# EAGLE board toyotune_3s_lvc_dil28 (EAGLE 5.11)
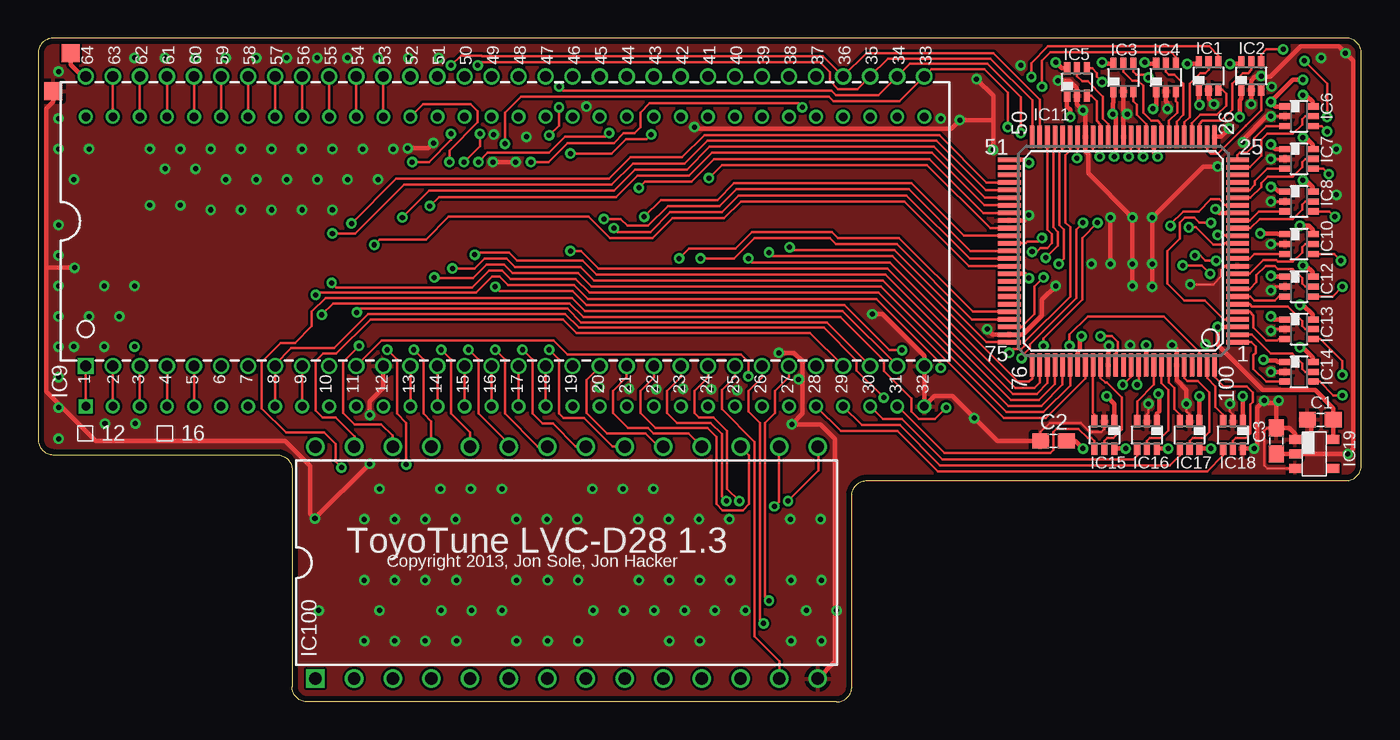
[diagram p4: board, top side]
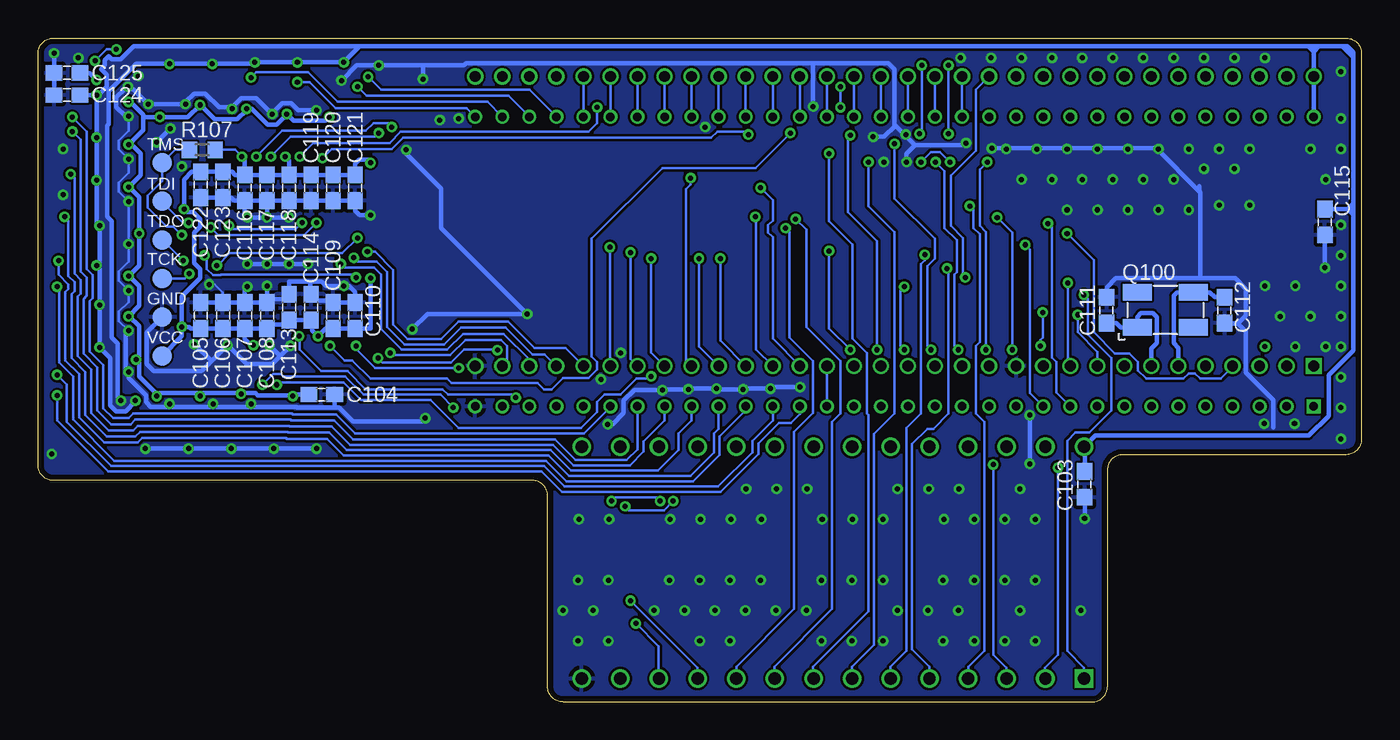
[diagram p5: board, bottom side, seen from below]

Size 87 x 43.65 mm. Coordinates in mm from the lower left corner, seen from the top.
Outline: 1.05,43.65 arc90 0,42.65 0,17.25 arc90 1,16.25 15.7,16.25 arc-90 16.7,15.25 16.7,1 arc90 17.7,0 52.5,0 arc90 53.5,1 53.5,13.55 arc-90 54.5,14.55 86,14.55 arc90 87,15.55 87,42.65 arc90 86,43.65 1.05,43.65
Copper layers (1*16): Top 0.0356mm / dielectric 1.5011mm / Bottom 0.0356mm
Design rules "laen-pcb-order *": minimum track width 6mil, minimum drill 13mil, track to track 6mil, track to pad 6mil, pad to pad 6mil, via to via 6mil, smd to smd 6mil, copper to edge 15mil, drill to drill 6mil, minimum pad ring 7mil, minimum via ring 7mil, stop-mask expansion 4mil, vias tented up to drill 13mil, thermal gap 10mil

## Footprints (pad centres in the part's own frame; a part is rotated, then mirrored left to right if it is on the bottom)
C0603 = smd 1.1 x 1: 1 -0.85,0; 2 0.85,0
DCK_R-PDSO-G6 = smd 0.4 x 0.8: 1 -0.65,-0.9; 2 0,-0.9; 3 0.65,-0.9; 4 0.65,0.9; 5 0,0.9; 6 -0.65,0.9
SDIP-64 = drill 0.711 square: 1 -27.559,-9.525 | drill 0.711 round: 2 -25.781,-9.525; 3 -24.003,-9.525; 4 -22.225,-9.525; 5 -20.447,-9.525; 6 -18.669,-9.525; 7 -16.891,-9.525; 8 -15.113,-9.525; 9 -13.335,-9.525; 10 -11.557,-9.525; 11 -9.779,-9.525; 12 -8.001,-9.525; 13 -6.223,-9.525; 14 -4.445,-9.525; 15 -2.667,-9.525; 16 -0.889,-9.525; 17 0.889,-9.525; 18 2.667,-9.525; 19 4.445,-9.525; 20 6.223,-9.525; 21 8.001,-9.525; 22 9.779,-9.525; 23 11.557,-9.525; 24 13.335,-9.525; 25 15.113,-9.525; 26 16.891,-9.525; 27 18.669,-9.525; 28 20.447,-9.525; 29 22.225,-9.525; 30 24.003,-9.525; 31 25.781,-9.525; 32 27.559,-9.525; 33 27.559,9.525; 34 25.781,9.525; 35 24.003,9.525; 36 22.225,9.525; 37 20.447,9.525; 38 18.669,9.525; 39 16.891,9.525; 40 15.113,9.525; 41 13.335,9.525; 42 11.557,9.525; 43 9.779,9.525; 44 8.001,9.525; 45 6.223,9.525; 46 4.445,9.525; 47 2.667,9.525; 48 0.889,9.525; 49 -0.889,9.525; 50 -2.667,9.525; 51 -4.445,9.525; 52 -6.223,9.525; 53 -8.001,9.525; 54 -9.779,9.525; 55 -11.557,9.525; 56 -13.335,9.525; 57 -15.113,9.525; 58 -16.891,9.525; 59 -18.669,9.525; 60 -20.447,9.525; 61 -22.225,9.525; 62 -24.003,9.525; 63 -25.781,9.525; 64 -27.559,9.525
VQ100 = smd 1.5 x 0.3: 1 -7.5,6; 2 -7.5,5.5; 3 -7.5,5; 4 -7.5,4.5; 5 -7.5,4; 6 -7.5,3.5; 7 -7.5,3; 8 -7.5,2.5; 9 -7.5,2; 10 -7.5,1.5; 11 -7.5,1; 12 -7.5,0.5; 13 -7.5,0; 14 -7.5,-0.5; 15 -7.5,-1; 16 -7.5,-1.5; 17 -7.5,-2; 18 -7.5,-2.5; 19 -7.5,-3; 20 -7.5,-3.5; 21 -7.5,-4; 22 -7.5,-4.5; 23 -7.5,-5; 24 -7.5,-5.5; 25 -7.5,-6; 51 7.5,-6; 52 7.5,-5.5; 53 7.5,-5; 54 7.5,-4.5; 55 7.5,-4; 56 7.5,-3.5; 57 7.5,-3; 58 7.5,-2.5; 59 7.5,-2; 60 7.5,-1.5; 61 7.5,-1; 62 7.5,-0.5; 63 7.5,0; 64 7.5,0.5; 65 7.5,1; 66 7.5,1.5; 67 7.5,2; 68 7.5,2.5; 69 7.5,3; 70 7.5,3.5; 71 7.5,4; 72 7.5,4.5; 73 7.5,5; 74 7.5,5.5; 75 7.5,6 | smd 0.3 x 1.5: 26 -6,-7.5; 27 -5.5,-7.5; 28 -5,-7.5; 29 -4.5,-7.5; 30 -4,-7.5; 31 -3.5,-7.5; 32 -3,-7.5; 33 -2.5,-7.5; 34 -2,-7.5; 35 -1.5,-7.5; 36 -1,-7.5; 37 -0.5,-7.5; 38 0,-7.5; 39 0.5,-7.5; 40 1,-7.5; 41 1.5,-7.5; 42 2,-7.5; 43 2.5,-7.5; 44 3,-7.5; 45 3.5,-7.5; 46 4,-7.5; 47 4.5,-7.5; 48 5,-7.5; 49 5.5,-7.5; 50 6,-7.5; 76 6,7.5; 77 5.5,7.5; 78 5,7.5; 79 4.5,7.5; 80 4,7.5; 81 3.5,7.5; 82 3,7.5; 83 2.5,7.5; 84 2,7.5; 85 1.5,7.5; 86 1,7.5; 87 0.5,7.5; 88 0,7.5; 89 -0.5,7.5; 90 -1,7.5; 91 -1.5,7.5; 92 -2,7.5; 93 -2.5,7.5; 94 -3,7.5; 95 -3.5,7.5; 96 -4,7.5; 97 -4.5,7.5; 98 -5,7.5; 99 -5.5,7.5; 100 -6,7.5
DDC_R-PDSO-G5 = smd 0.6 x 0.8: 1 -0.95,-1.25; 2 0,-1.25; 3 0.95,-1.25; 4 0.95,1.25; 5 -0.95,1.25
PDIP28 = drill 0.813 square: 1 -16.51,-7.62 | drill 0.813 round: 2 -13.97,-7.62; 3 -11.43,-7.62; 4 -8.89,-7.62; 5 -6.35,-7.62; 6 -3.81,-7.62; 7 -1.27,-7.62; 8 1.27,-7.62; 9 3.81,-7.62; 10 6.35,-7.62; 11 8.89,-7.62; 12 11.43,-7.62; 13 13.97,-7.62; 14 16.51,-7.62; 15 16.51,7.62; 16 13.97,7.62; 17 11.43,7.62; 18 8.89,7.62; 19 6.35,7.62; 20 3.81,7.62; 21 1.27,7.62; 22 -1.27,7.62; 23 -3.81,7.62; 24 -6.35,7.62; 25 -8.89,7.62; 26 -11.43,7.62; 27 -13.97,7.62; 28 -16.51,7.62
1X06_SMD = smd 1.27 x 1.27: GND 3.81,0; TCK 1.27,0; TDI -3.81,0; TDO -1.27,0; TMS -6.35,0; VCC 6.35,0
CRYSTAL-SMD-5X3 = smd 1.9 x 1.1: 1 -1.85,-1.15; 2 1.85,-1.15; 3 1.85,1.15; 4 -1.85,1.15
R0603 = smd 1 x 1.1: 1 -0.85,0; 2 0.85,0
TP12SQ = smd 1.2 x 1.2: TP 0,0
SDIP-64-CONN = drill 0.559 square: 1 -27.559,-9.525 | drill 0.559 round: 2 -25.781,-9.525; 3 -24.003,-9.525; 4 -22.225,-9.525; 5 -20.447,-9.525; 6 -18.669,-9.525; 7 -16.891,-9.525; 8 -15.113,-9.525; 9 -13.335,-9.525; 10 -11.557,-9.525; 11 -9.779,-9.525; 12 -8.001,-9.525; 13 -6.223,-9.525; 14 -4.445,-9.525; 15 -2.667,-9.525; 16 -0.889,-9.525; 17 0.889,-9.525; 18 2.667,-9.525; 19 4.445,-9.525; 20 6.223,-9.525; 21 8.001,-9.525; 22 9.779,-9.525; 23 11.557,-9.525; 24 13.335,-9.525; 25 15.113,-9.525; 26 16.891,-9.525; 27 18.669,-9.525; 28 20.447,-9.525; 29 22.225,-9.525; 30 24.003,-9.525; 31 25.781,-9.525; 32 27.559,-9.525; 33 27.559,9.525; 34 25.781,9.525; 35 24.003,9.525; 36 22.225,9.525; 37 20.447,9.525; 38 18.669,9.525; 39 16.891,9.525; 40 15.113,9.525; 41 13.335,9.525; 42 11.557,9.525; 43 9.779,9.525; 44 8.001,9.525; 45 6.223,9.525; 46 4.445,9.525; 47 2.667,9.525; 48 0.889,9.525; 49 -0.889,9.525; 50 -2.667,9.525; 51 -4.445,9.525; 52 -6.223,9.525; 53 -8.001,9.525; 54 -9.779,9.525; 55 -11.557,9.525; 56 -13.335,9.525; 57 -15.113,9.525; 58 -16.891,9.525; 59 -18.669,9.525; 60 -20.447,9.525; 61 -22.225,9.525; 62 -24.003,9.525; 63 -25.781,9.525; 64 -27.559,9.525

## Placement (x,y rotation side)
C1  1uF  [C0603]  84.3,18.55 180 top
C2  0.1uF  [C0603]  66.75,17.15 0 top
C3  1uF  [C0603]  81.4,17.15 270 top
C103  0.1uF  [C0603]  18.2,14.3 90 bottom
C104  0.1uF  [C0603]  68.35,20.2 180 bottom
C105  0.1uF  [C0603]  76.3,25.4 270 bottom
C106  0.01uF  [C0603]  74.85,25.4 270 bottom
C107  0.1uF  [C0603]  73.4,25.4 270 bottom
C108  0.01uF  [C0603]  71.95,25.4 270 bottom
C109  0.01uF  [C0603]  67.6,25.4 270 bottom
C110  0.1uF  [C0603]  66.15,25.4 270 bottom
C111  10pF  [C0603]  16.75,25.75 90 bottom
C112  10pF  [C0603]  9,25.75 90 bottom
C113  0.01uF  [C0603]  70.5,25.95 270 bottom
C114  0.1uF  [C0603]  69.05,25.95 270 bottom
C115  0.1uF  [C0603]  2.4,31.55 90 bottom
C116  0.1uF  [C0603]  73.4,33.8 90 bottom
C117  0.01uF  [C0603]  71.95,33.8 90 bottom
C118  0.01uF  [C0603]  70.5,33.8 90 bottom
C119  0.1uF  [C0603]  69.05,33.8 90 bottom
C120  0.1uF  [C0603]  67.6,33.8 90 bottom
C121  0.01uF  [C0603]  66.15,33.8 90 bottom
C122  0.01uF  [C0603]  76.3,34 90 bottom
C123  0.1uF  [C0603]  74.85,34 90 bottom
C124  0.1uF  [C0603]  85.1,39.9 0 bottom
C125  0.1uF  [C0603]  85.1,41.35 0 bottom
IC1  SN74LVC1T45DCK  [DCK_R-PDSO-G6]  76.95,41.15 0 top
IC2  SN74LVC1T45DCK  [DCK_R-PDSO-G6]  79.75,41.15 0 top
IC3  SN74LVC1T45DCK  [DCK_R-PDSO-G6]  71.35,41.05 0 top
IC4  SN74LVC1T45DCK  [DCK_R-PDSO-G6]  74.15,41.05 0 top
IC5  SN74LVC1T45DCK  [DCK_R-PDSO-G6]  68.3,40.75 0 top
IC6  SN74LVC1T45DCK  [DCK_R-PDSO-G6]  82.9,38.5 270 top
IC7  SN74LVC1T45DCK  [DCK_R-PDSO-G6]  82.9,35.7 270 top
IC8  SN74LVC1T45DCK  [DCK_R-PDSO-G6]  82.9,32.9 270 top
IC9  D15180X-XXXX  [SDIP-64]  30.7,31.6 0 top
IC10  SN74LVC1T45DCK  [DCK_R-PDSO-G6]  82.9,30.1 270 top
IC11  XCR3128XL  [VQ100]  71.35,29.65 180 top
IC12  SN74LVC1T45DCK  [DCK_R-PDSO-G6]  82.9,27.3 270 top
IC13  SN74LVC1T45DCK  [DCK_R-PDSO-G6]  82.9,24.5 270 top
IC14  SN74LVC1T45  [DCK_R-PDSO-G6]  82.9,21.7 270 top
IC15  SN74LVC1T45DCK  [DCK_R-PDSO-G6]  70.1,17.55 180 top
IC16  SN74LVC1T45DCK  [DCK_R-PDSO-G6]  72.9,17.55 180 top
IC17  SN74LVC1T45DCK  [DCK_R-PDSO-G6]  75.7,17.55 180 top
IC18  SN74LVC1T45DCK  [DCK_R-PDSO-G6]  78.55,17.55 180 top
IC19  TLV70033  [DDC_R-PDSO-G5]  83.9,16.3 270 top
IC100  AT29C256  [PDIP28]  34.75,9.15 0 top
JP100  JTAG  [1X06_SMD]  78.85,29.1 270 bottom
Q100  16Mhz  [CRYSTAL-SMD-5X3]  12.89,25.77 0 bottom
R107  10K  [R0603]  76.2,36.3 0 bottom
TP_GND  TPSQTP12SQ  [TP12SQ]  1,40.15 0 top
TP_VCC  TPSQTP12SQ  [TP12SQ]  2.15,42.65 0 top
U1  D151803-CONN  [SDIP-64-CONN]  30.7,28.95 0 top

## Tracks (layer width: path | path; a pad name or v marks a point on that pad's centre or on a via)
!D_HALT
  Bottom 0.178: IC9.51 U1.51
!D_INIT  (via drill 0.33)
  Top 0.178: IC11.81 67.85,20.8 66.1,19.05 63.65,19.05 55.4,27.3 36.4,27.3 35.5,28.2 31.2,28.2 30.65,28.75 29.5,28.75 28.6,27.85 26.1,27.85 v26.05,27.9
  Bottom 0.178: v26.05,27.9 26.2,28.05 26.2,30.5 27,31.3 27,34.6 25.35,36.25 25.35,40.25 IC9.52
!D_IRL
  Top 0.178: IC9.5 U1.5
!D_IRP  (via drill 0.33)
  Top 0.178: IC9.4 U1.4 | IC11.55 62.3,33.65 59.05,36.9 44,36.9 42.5,35.4 39.1,35.4 37.7,34 24.05,34 20.85,30.8 v19.35,30.8
  Bottom 0.178: IC9.4 8.47,22.02 9.25,21.25 10.6,21.25 10.95,21.6 11.35,21.6 11.7,21.25 14.15,21.25 14.7,21.8 14.7,22.35 15.25,22.9 16.2,22.9 17.6,24.3 17.6,29.05 v19.35,30.8
!D_NMI
  Top 0.178: IC9.3 U1.3
!D_RD  (via drill 0.33)
  Top 0.178: IC11.83 68.85,21.25 66.25,18.65 63.5,18.65 55.25,26.9 36.25,26.9 35.35,27.8 31.05,27.8 30.5,28.35 29.65,28.35 28.55,27.25 19.6,27.25 v19.3,27.55
  Bottom 0.178: IC9.10 19.3,22.23 v19.3,27.55
!D_TEST
  Bottom 0.178: U1.49 IC9.49
!D_WDC
  Top 0.178: IC9.53 U1.53
!D_WI
  Bottom 0.178: IC9.50 U1.50
!D_WR  (via drill 0.33)
  Top 0.178: v46.7,21.4 46.7,22.35 46.2,22.85 34.8,22.85 33.9,23.75 22.6,23.75 IC9.11 | IC11.89 71.85,21.35 71.3,20.8 v71.3,20.85
  Bottom 0.178: v46.7,21.4 46.85,21.25 47.65,21.25 48.7,20.2 49.75,20.2 50.25,19.7 50.25,19.05 51.3,18 59.35,18 61.2,19.85 65.75,19.85 66.9,21 71.15,21 v71.3,20.85
!E_INIT  (via drill 0.33)
  Top 0.178: IC11.98 76.35,23 74,25.35 69,25.35 67.8,24.15 v67.8,23.4 | U1.52 25.3,39.3 28.45,39.3 28.9,38.85 28.9,38.1 27.05,36.25 v27.05,35.5 | v37.55,37.4 37.3,37.15 34.65,37.15 33.6,36.1 29.55,36.1 v28.95,35.5
  Bottom 0.178: v37.55,37.4 39.85,35.1 45.95,35.1 50.6,30.45 50.6,22.7 50.25,22.35 50.25,21.85 50.8,21.3 52.5,21.3 53.25,20.55 53.75,20.55 54.15,20.95 59.8,20.95 60.1,21.25 65.15,21.25 66.35,22.45 66.85,22.45 v67.8,23.4 | v28.95,35.5 28.3,36.15 27.7,36.15 v27.05,35.5
!E_IS  (via drill 0.33)
  Top 0.178: IC11.54 62.35,34.15 59.25,37.25 43.8,37.25 42.35,35.8 38.95,35.8 37.55,34.4 23.55,34.4 v20.6,31.45
  Bottom 0.178: U1.10 20.05,20.33 20.05,22.35 20.35,22.65 20.35,31.2 v20.6,31.45
!E_OS  (via drill 0.33)
  Top 0.178: IC11.65 61.2,28.65 56.95,32.9 46.2,32.9 45.1,31.8 41.7,31.8 40.4,30.5 37.6,30.5 36.2,31.9 27,31.9 25.5,30.4 22.45,30.4 v22.1,30.05
  Bottom 0.178: U1.11 21.8,20.3 21.8,24.4 21.8,29.75 v22.1,30.05
!M_RD  (via drill 0.33)
  Top 0.178: IC11.14 78.05,30.15 77.95,30.05 77.25,30.05 76.1,31.2 v75.65,31.2 | v30.05,23.15 30.7,22.5 30.7,18.95 32.85,16.8 33.45,16.8 IC100.22 | v30.05,27.3 30.35,27 35.15,27 36.05,26.1 53,26.1 55.97,23.12 v56.8,23.12 | v68.7,31.5 68.25,31.05 68.25,26.55 65.2,23.5 65.2,23.25 64.65,22.7 v64.65,22.6
  Bottom 0.178: v75.65,31.2 75.15,30.7 69.5,30.7 v68.7,31.5 | v30.05,23.15 30.3,23.4 30.3,27.05 v30.05,27.3 | v56.8,23.12 56.77,23.15 59,23.15 59.85,22.3 64.35,22.3 v64.65,22.6
!M_ROM_CS  (via drill 0.33)
  Top 0.178: IC11.78 66.35,20.95 65.65,20.25 64.1,20.25 55.85,28.5 36.85,28.5 35.7,29.65 v35,29.65 | v33.6,23.15 34.25,22.5 34.25,18.95 34.55,18.65 35.9,18.65 37.75,16.8 38.53,16.8 IC100.20
  Bottom 0.178: v33.6,23.15 35,24.55 v35,29.65
!M_WR  (via drill 0.33)
  Top 0.178: IC11.19 78.05,32.65 77.65,33.05 77.1,33.05 76.3,32.25 75.3,32.25 74.45,31.4 v74.45,31.3 | v59.35,21.95 59.35,22.25 55.1,26.5 36.15,26.5 35.25,27.4 30.9,27.4 30.35,27.95 29.85,27.95 28.8,26.9 18.4,26.9 v18.25,26.75 | v66.1,23.4 66.1,23.9 68.65,26.45 68.65,30.5 v69.65,31.5
  Bottom 0.178: v74.45,31.3 74.25,31.1 70.05,31.1 v69.65,31.5 | v18.25,26.75 18,26.5 18,24.15 16.45,22.6 16.45,19.15 17.9,17.7 18.8,17.7 19.35,17.15 19.35,3.35 18.24,2.24 IC100.1 | v66.1,23.4 66.1,23.2 64.85,21.95 v59.35,21.95
C_DRA0
  Top 0.178: IC11.30 75.35,38.1 75.7,38.45 75.7,40.65 76.4,41.35 76.75,41.35 76.95,41.55 IC1.5
C_DRA1
  Top 0.178: IC4.5 74.15,41.45 74.35,41.25 74.7,41.25 75.3,40.65 75.3,38.6 74.85,38.15 IC11.31
C_DRA2
  Top 0.178: IC3.5 71.35,41.45 71.95,40.85 72.3,40.85 72.65,40.5 72.65,38.75 73.2,38.2 73.6,38.2 73.85,37.95 IC11.33
C_DRA3
  Top 0.178: IC11.40 70.35,38 70,38.35 70,39.8 69,40.8 68.65,40.8 68.3,41.15 IC5.5
C_DRA4
  Top 0.178: IC15.5 70.1,17.15 70.3,17.35 70.7,17.35 71.25,17.9 71.25,20 70.25,21 70.15,21 69.85,21.3 IC11.85
C_DRA5
  Top 0.178: IC16.5 72.9,17.15 73.1,17.35 73.8,17.35 74.3,17.85 74.3,20.5 73.85,20.95 IC11.93
C_DRA6
  Top 0.178: IC17.5 75.7,17.15 75.9,17.35 76.6,17.35 77,17.75 77,20.35 76.25,21.1 75.55,21.1 75.35,21.3 IC11.96
C_DRA7
  Top 0.178: IC18.5 78.55,17.15 78.75,17.35 79.4,17.35 79.7,17.65 79.7,19.55 79.85,19.7 79.85,20.35 79.45,20.75 77.95,20.75 77.35,21.35 IC11.100
C_DRB0
  Top 0.178: IC11.28 76.35,38 76.55,38.2 77.75,38.2 78.5,38.95 78.5,40.65 79.2,41.35 79.55,41.35 79.75,41.55 IC2.5
C_DRB1
  Top 0.178: IC11.24 79.65,35.15 80.4,35.9 80.4,36.95 80.8,37.35 82.5,37.35 83.1,37.95 83.1,38.3 83.3,38.5 IC6.5
C_DRB2
  Top 0.178: IC11.20 79.7,33.15 80.4,33.85 80.4,34.1 80.85,34.55 82.5,34.55 83.1,35.15 83.1,35.5 83.3,35.7 IC7.5
C_DRB3
  Top 0.178: IC11.16 79.7,31.15 80.3,31.75 82.5,31.75 83.1,32.35 83.1,32.7 83.3,32.9 IC8.5
C_DRB4
  Top 0.178: IC11.10 79.65,28.15 80.55,29.05 81.4,29.05 81.5,28.95 82.5,28.95 83.1,29.55 83.1,29.9 83.3,30.1 IC10.5
C_DRB5
  Top 0.178: IC11.8 79.65,27.15 80.1,27.6 80.1,28.05 80.7,28.65 81.3,28.65 81.5,28.45 82.5,28.45 83.1,27.85 83.1,27.5 83.3,27.3 IC12.5
C_DRB6
  Top 0.178: IC11.6 79.65,26.15 79.8,26 82.15,26 83.1,25.05 83.1,24.7 83.3,24.5 IC13.5
C_DRB7
  Top 0.178: IC14.5 83.3,21.7 83.1,21.9 83.1,22.25 82.45,22.9 81.05,22.9 79.8,24.15 IC11.2
C_PA0
  Top 0.178: IC1.3 77.85,40.25 78.1,40 78.1,39.2 77.5,38.6 76.4,38.6 75.85,38.05 IC11.29
C_PA1
  Top 0.178: IC11.32 74.35,38.2 74.9,38.75 74.9,39.4 74.8,39.5 IC4.3
C_PA2
  Top 0.178: IC3.3 72,39.5 72.25,39.25 72.25,38.6 72.85,38 IC11.35
C_PA3
  Top 0.178: IC5.3 69.25,39.85 69.6,39.5 69.6,38.2 69.85,37.95 IC11.41
C_PA4
  Top 0.178: IC15.3 69.45,18.9 69.35,19 IC11.84
C_PA5
  Top 0.178: 73.35,22.35 IC11.92 73.35,20.85 72.25,19.75 IC16.3
C_PA6
  Top 0.178: 74.35,22.3 IC11.94 74.35,21 74.7,20.65 74.7,19.25 75.05,18.9 IC17.3
C_PA7
  Top 0.178: IC11.99 76.85,21.3 77.4,20.75 77.4,19.4 77.9,18.9 IC18.3
C_PB0
  Top 0.178: IC2.3 80.4,38.9 79.4,37.9 77.55,36.05 | IC11.27 76.85,36.3 77.1,36.05 77.55,36.05 | 77.55,36.05
C_PB1
  Top 0.178: 78.85,35.95 | 78.85,35.95 79,36.1 79.45,36.1 79.95,36.6 79.95,37.05 80.75,37.85 IC6.3 | IC11.25 78.85,35.95
C_PB2
  Top 0.178: IC7.3 80.8,35.05 80,34.25 80,34 79.65,33.65 IC11.21
C_PB3
  Top 0.178: IC11.17 79.65,31.65 80.25,32.25 IC8.3
C_PB4
  Top 0.178: IC10.3 79.95,29.45 79.65,29.15 IC11.12
C_PB5
  Top 0.178: IC11.7 79.7,26.65 79.95,26.4 81.3,26.4 81.55,26.65 IC12.3
C_PB6
  Top 0.178: IC13.3 81.55,23.85 81.45,23.75 80.75,23.75 79.9,24.6 79.9,25.4 79.65,25.65 IC11.5
C_PB7
  Top 0.178: IC14.3 80.75,21.05 79.9,21.9 79.9,22.8 80.05,22.95 80.05,23.35 79.75,23.65 IC11.1
D1_XIN
  Bottom 0.305: IC9.6 12.03,23.28 12.35,23.6 12.35,26.7 12.13,26.92 Q100.3 9.97,26.92 9.65,26.6 C112.2
D1_XOUT
  Bottom 0.305: IC9.7 13.81,23.24 13.45,23.6 13.45,25.3 13.7,25.55 14.5,25.55 14.75,25.3 Q100.1 15.82,24.62 16.1,24.9 C111.1
D_A8  (via drill 0.33)
  Top 0.178: v24.7,23.15 25.35,22.5 25.35,18.95 25.85,18.45 IC100.25 | IC11.49 65.85,39.6 62.8,42.65 54.45,42.65 IC9.36 51.6,42.45 29.2,42.45 29.15,42.5 27.8,42.5 v27.15,41.85 | v24.6,35.5 25.7,35.5 27.15,36.95 v27.15,37.35
  Bottom 0.178: v24.7,23.15 24.7,30.9 25.1,31.3 25.1,35 v24.6,35.5 | v27.15,37.35 v27.15,41.85
D_A9  (via drill 0.33)
  Top 0.178: v26.5,23.15 27.15,22.5 27.15,18.95 28.4,17.7 IC100.24 | IC11.50 65.35,39.55 62.6,42.3 55.88,42.3 IC9.35 53.88,40.3 52.6,40.3 52.05,40.85 52.05,41.4 51.4,42.05 29.1,42.05 v28.9,41.85 | v28,35.5 29.05,36.55 v29.05,37.35
  Bottom 0.178: v26.5,23.15 26.75,23.4 26.75,28.1 26.6,28.25 26.6,30.35 27.4,31.15 27.4,34.9 v28,35.5 | v29.05,37.35 28.9,37.5 v28.9,41.85
D_A10  (via drill 0.33)
  Top 0.178: v31.85,23.15 32.5,22.5 32.5,18.95 33.15,18.3 33.85,18.3 35.35,16.8 36,16.8 IC100.21 | IC11.37 71.85,36 v71.7,35.85 | v64.6,37.4 64.6,39.75 62.4,41.95 57.31,41.95 IC9.34 55.26,39.9 52.45,39.9 52.15,40.2 34.5,40.2 v34.25,40.45 | v33.6,37.25 34.25,37.9 v34.25,39.1
  Bottom 0.178: v31.85,23.15 31.85,30.3 33.75,32.2 33.75,37.1 v33.6,37.25 | v71.7,35.85 70.4,37.15 64.85,37.15 v64.6,37.4 | v34.25,39.1 v34.25,40.45
D_A11  (via drill 0.33)
  Top 0.178: v28.3,23.15 28.95,22.5 28.95,18.95 30.95,16.95 IC100.23 | IC11.36 72.35,36.15 v72.65,35.85 | v63.75,37.8 63.75,40.05 62.2,41.6 58.73,41.6 IC9.33 56.63,39.5 52.3,39.5 52,39.8 31.75,39.8 30.7,38.75 v30.7,36.7
  Bottom 0.178: v28.3,23.15 28.55,23.4 28.55,28.65 28.05,29.15 28.05,30.45 30.7,33.1 v30.7,36.7 | v72.65,35.85 70.95,37.55 65.45,37.55 64.95,38.05 64,38.05 v63.75,37.8
D_A12  (via drill 0.33)
  Top 0.178: IC11.45 67.85,36.25 67.55,35.95 67.55,31.5 67.85,31.2 67.85,26.65 64.85,23.65 64.85,23.4 64.65,23.2 64.1,23.2 v63.85,22.95 | IC9.31 56.48,22.1 52.88,25.7 35.95,25.7 35.1,26.55 18.9,26.55 18,25.65 18,24.7 16.9,23.6 15.95,23.6 14.7,22.35 14.7,19.3 16.3,17.7 18.8,17.7 19.55,16.95 19.55,15.8 v19.95,15.4
  Bottom 0.178: v63.85,22.95 63.7,22.8 59.9,22.8 58.9,23.8 56.55,23.8 56.15,23.4 56.15,22.4 IC9.31 | IC100.2 20.8,1.55 20.8,2.25 19.95,3.1 v19.95,15.4
D_A13  (via drill 0.33)
  Top 0.178: IC11.46 67.35,36.3 67.15,36.1 67.15,31.35 67.45,31.05 67.45,29.15 v67.1,28.8 | IC9.30 54.7,22.1 51.85,24.95 35.7,24.95 34.8,25.85 21.2,25.85 v20.95,25.6 | v21.1,23.4 20.05,22.35 20.05,19 20.8,18.25 22.55,18.25 23.3,17.5 23.3,16.79 IC100.26
  Bottom 0.178: v67.1,28.8 66.85,28.55 64.9,28.55 64.45,28.1 64.45,24.5 63.1,23.15 60.1,23.15 59.05,24.2 56.4,24.2 54.7,22.5 IC9.30 | v20.95,25.6 20.95,23.95 21.1,23.8 v21.1,23.4
D_A14  (via drill 0.33)
  Top 0.178: IC11.47 66.85,36.35 66.75,36.25 66.75,31.2 67.05,30.9 67.05,30 v66.25,29.2 | IC9.29 52.92,22.1 52.9,22.1 50.75,24.25 35.4,24.25 34.5,25.15 21.85,25.15 19.6,22.9 18.75,22.9 18.25,22.4 18.25,19.15 18.7,18.7 19.55,18.7 20.8,17.45 20.8,16.79 IC100.27
  Bottom 0.178: v66.25,29.2 66,28.95 64.75,28.95 64.05,28.25 64.05,24.65 62.9,23.5 60.3,23.5 59.2,24.6 56.25,24.6 54.5,22.85 53.7,22.85 IC9.29
D_A15  (via drill 0.33)
  Top 0.178: IC11.48 66.35,31.05 66.65,30.75 66.65,30.15 66.35,29.85 65.9,29.85 65.65,29.6 v65.35,29.6
  Bottom 0.178: v65.35,29.6 64.85,29.6 63.65,28.4 63.65,24.8 62.7,23.85 60.5,23.85 59.35,25 56.1,25 54.35,23.25 52.32,23.25 IC9.28
D_ADR  (via drill 0.33)
  Top 0.178: IC9.9 U1.9 | IC11.90 72.35,20.95 v72.25,20.85 | v18.65,25.45 19.4,26.2 34.95,26.2 35.85,25.3 52.75,25.3 55.6,22.45 55.6,21.75 57.4,19.95 57.4,19.1 57.9,18.6 58.95,18.6 v59.7,19.35
  Bottom 0.178: IC9.9 17.36,23.02 18.65,24.3 v18.65,25.45 | v72.25,20.85 71.55,21.55 71.05,21.55 70.9,21.4 66.8,21.4 65.6,20.2 60.55,20.2 v59.7,19.35
D_AL0  (via drill 0.33)
  Top 0.178: IC11.64 61.25,29.15 57.1,33.3 46.05,33.3 44.95,32.2 41.55,32.2 40.25,30.9 38.1,30.9 v37.85,31.15
  Bottom 0.178: v37.85,31.15 37.6,30.9 37.6,23.95 36.05,22.4 36.05,19 37.3,17.75 37.3,6.1 41.1,2.3 IC100.10
D_AL1  (via drill 0.33)
  Top 0.178: IC11.63 61.3,29.65 57.25,33.7 45.9,33.7 44.8,32.6 41.4,32.6 40.1,31.3 38.75,31.3 38.3,31.75 v37.2,31.75
  Bottom 0.178: v37.2,31.75 36.5,31.05 36.5,24.65 34.25,22.4 34.25,18.95 34.8,18.4 34.8,6.1 38.6,2.3 38.6,1.57 IC100.9
D_AL2  (via drill 0.33)
  Top 0.178: v68.3,35.75 68.3,36.2 68.35,36.25 IC11.44 | v40.3,37.3 40,37 38.65,37 37.7,36.05 v35,36.05
  Bottom 0.178: v68.3,35.75 67.7,36.35 63.75,36.35 63,37.1 42.75,37.1 42.35,37.5 40.5,37.5 v40.3,37.3 | v35,36.05 35,31.6 33.45,30.05 33.45,23.9 32.5,22.95 32.5,18.95 32.4,18.85 32.4,5.95 36.05,2.3 36.05,1.56 IC100.8
D_AL3  (via drill 0.33)
  Top 0.178: IC11.42 69.35,36.3 v69.8,35.85 | v50.25,39.1 50,39.35 40.2,39.35 39.6,38.75 39.6,37.8 39.2,37.4 38.5,37.4 37.85,36.75 34.8,36.75 33.55,35.5 v32.4,35.5
  Bottom 0.178: v32.4,35.5 32.4,32.6 30.7,30.9 30.7,18.95 32.05,17.6 32.05,3.75 33.5,2.3 33.5,1.55 IC100.7 | v69.8,35.85 68.9,36.75 63.9,36.75 63.15,37.5 50.8,37.5 50.25,38.05 v50.25,39.1
D_AL4  (via drill 0.33)
  Top 0.178: IC11.79 66.85,20.9 65.8,19.85 63.95,19.85 55.7,28.1 36.7,28.1 35.8,29 31.5,29 30.95,29.55 28.85,29.55 v28.7,29.4
  Bottom 0.178: v28.7,29.4 28.7,29.05 28.95,28.8 28.95,18.95 29.9,18 29.9,3.35 30.95,2.3 IC100.6
D_AL5  (via drill 0.33)
  Top 0.178: IC11.80 67.35,20.85 65.95,19.45 63.8,19.45 55.55,27.7 36.55,27.7 35.65,28.6 31.35,28.6 30.8,29.15 29.35,29.15 28.7,28.5 v27.25,28.5
  Bottom 0.178: v27.25,28.5 27.15,28.4 27.15,18.95 28.15,17.95 28.55,17.95 29.55,16.95 29.55,3.45 28.4,2.3 IC100.5
D_AL6  (via drill 0.33)
  Top 0.178: IC11.57 62.2,32.65 58.75,36.1 44.3,36.1 42.8,34.6 39.4,34.6 38,33.2 26.35,33.2 v25.75,32.6
  Bottom 0.178: v25.75,32.6 25.5,32.35 25.5,31.15 25.1,30.75 25.1,23.65 25.35,23.4 25.35,18.95 24.8,18.4 24.8,3.35 25.85,2.3 IC100.4
D_AL7  (via drill 0.33)
  Top 0.178: v22.95,23.15 23.6,22.5 23.6,18.95 24.2,18.35 v24.2,15.6 | IC11.56 62.25,33.15 58.9,36.5 44.15,36.5 42.65,35 39.25,35 37.85,33.6 25.7,33.6 v23.95,31.85
  Bottom 0.178: v22.95,23.15 22.95,30.85 v23.95,31.85 | IC100.3 23.35,1.56 23.35,2.25 24.2,3.1 v24.2,15.6
D_ASR0
  Top 0.178: IC9.2 U1.2
D_ASR1
  Top 0.178: IC9.1 U1.1
D_ASR2
  Top 0.178: IC9.63 U1.63
D_ASR3
  Top 0.178: IC9.62 U1.62
D_CCLK  (via drill 0.33)
  Top 0.178: U1.8 IC9.8 15.59,22.19 16.65,23.25 19.45,23.25 21.7,25.5 34.65,25.5 35.55,24.6 51.65,24.6 53.8,22.45 53.8,21.8 v55.6,20 | IC11.87 70.85,22.95 71,23.1 71,23.65 70.6,24.05 v69.85,24.05
  Bottom 0.178: v69.85,24.05 69.8,24 69.8,23.15 68.4,21.75 66.65,21.75 65.45,20.55 60.4,20.55 60.05,20.2 55.8,20.2 v55.6,20
D_DA0  (via drill 0.33)
  Top 0.178: IC9.27 49.37,21.37 48.45,20.45 48.45,19 47.8,18.35 47.8,6.9 v48.05,6.65 | IC11.75 62.35,23.65 56.3,29.7 49.6,29.7 v49.4,29.9 | IC11.75 63.95,23.65 64,23.7 63.9,23.7 IC11.75
  Bottom 0.178: 49.35,22.09 IC9.27 49.4,22.11 v49.4,29.9 | IC100.11 43.65,2.25 v48.05,6.65
D_DA1  (via drill 0.33)
  Top 0.178: IC9.26 47.59,21.34 46.7,20.45 46.7,19.1 47.45,18.35 47.45,5.4 v47.7,5.15 | IC11.76 65.35,21.25 65.15,21.05 64.4,21.05 56.15,29.3 48.3,29.3 v48.05,29.55
  Bottom 0.178: IC9.26 48.05,22.55 v48.05,29.55 | IC100.12 46.2,1.55 46.2,3.65 v47.7,5.15
D_DA2  (via drill 0.33)
  Top 0.178: IC9.25 45.81,21.36 44.95,20.5 44.95,19.25 47.1,17.1 47.1,4.3 48.75,2.65 48.75,1.56 IC100.13 | IC11.77 65.85,21 65.5,20.65 64.25,20.65 56,28.9 46.95,28.9 v46.7,29.15
  Bottom 0.178: IC9.25 46.7,22.96 v46.7,29.15
D_DA3  (via drill 0.33)
  Top 0.178: IC9.24 44.03,21.34 43.15,20.45 43.15,19 43.45,18.7 44.4,18.7 45.3,17.8 45.3,14 v46.1,13.2 | IC11.60 62.6,31.15 58.45,35.3 44.95,35.3 v44.1,34.45 | v49.3,13.2 51.3,15.2 51.3,16.7 51.26,16.74 IC100.15
  Bottom 0.178: IC9.24 44.4,22.44 44.4,33.7 44.1,34 v44.1,34.45 | v49.3,13.2 49.05,13.45 46.35,13.45 v46.1,13.2
D_DA4  (via drill 0.33)
  Top 0.178: IC9.23 42.26,21.36 41.35,20.45 41.35,19 42,18.35 44.2,18.35 44.95,17.6 44.95,13.5 v45.25,13.2 | IC11.72 61.4,25.15 56.45,30.1 52.45,30.1 52.05,30.5 47.1,30.5 45.75,29.15 v43.55,29.15 | v48.4,12.85 48.7,13.15 48.7,16.75 IC100.16
  Bottom 0.178: IC9.23 43.55,23.37 v43.55,29.15 | v45.25,13.2 45.85,12.6 48.15,12.6 v48.4,12.85
D_DA5  (via drill 0.33)
  Top 0.178: IC9.22 40.48,21.33 39.6,20.45 39.6,19 40.6,18 44,18 44.6,17.4 44.6,13 45,12.6 46.35,12.6 46.75,13 46.75,16.2 IC100.17 | IC11.71 61.45,25.65 56.6,30.5 52.6,30.5 52.2,30.9 46.95,30.9 45.85,29.8 42.8,29.8 v42.15,29.15
  Bottom 0.178: IC9.22 42.15,23.75 v42.15,29.15
D_DA6  (via drill 0.33)
  Top 0.178: IC9.21 38.7,21.35 37.8,20.45 37.8,19 38.8,18 40.1,18 40.45,17.65 42.76,17.65 IC100.18 | v39.85,31.9 40.95,33 44.65,33 45.75,34.1 57.4,34.1 60.85,30.65 IC11.61
  Bottom 0.178: IC9.21 39.8,23.18 39.8,31.9 v39.85,31.9
D_DA7  (via drill 0.33)
  Top 0.178: IC11.58 62.15,32.15 58.6,35.7 44.45,35.7 42.95,34.2 39.9,34.2 v39.5,33.8 | IC9.20 36.92,22.02 36.05,21.15 36.05,19 37.4,17.65 39.94,17.65 40.82,16.77 IC100.19
  Bottom 0.178: IC9.20 36.9,22.1 38.7,23.9 38.7,30.55 39,30.85 39,31.35 38.7,31.65 38.7,33 v39.5,33.8
D_DOUT0
  Top 0.178: IC9.61 U1.61
D_DOUT1
  Top 0.178: IC9.60 U1.60
D_DOUT2
  Top 0.178: IC9.59 U1.59
D_DOUT3
  Top 0.178: IC9.58 U1.58
D_DOUT4
  Top 0.178: IC9.57 U1.57
D_DOUT5
  Top 0.178: IC9.56 U1.56
D_DOUT6
  Top 0.178: IC9.55 U1.55
D_DOUT7
  Top 0.178: IC9.54 U1.54
D_PA0  (via drill 0.33)
  Top 0.178: IC1.4 77.6,42.5 77,43.1 66.4,43.1 65.3,42 v65.3,41.1
  Bottom 0.178: U1.36 54.7,40.25 64.45,40.25 v65.3,41.1
D_PA1  (via drill 0.33)
  Top 0.178: IC4.4 74.8,42.4 74.5,42.7 66.55,42.7 66,42.15 v66,40.45
  Bottom 0.178: U1.35 56.08,39.85 65.4,39.85 v66,40.45
D_PA2  (via drill 0.33)
  Top 0.178: IC3.4 72,41.45 72.2,41.25 72.8,41.25 v73,41.05
  Bottom 0.178: U1.34 57.46,39.45 67.3,39.45 69.25,41.4 72.65,41.4 v73,41.05
D_PA3  (via drill 0.33)
  Top 0.178: IC5.4 69.3,41.65 69.6,41.35 69.6,41.1 v69.95,40.75
  Bottom 0.178: U1.33 58.83,39.05 67.45,39.05 69.15,40.75 v69.95,40.75
D_PA4
  Top 0.178: IC15.4 69.45,17.15 69.25,17.35 69,17.35 68.4,17.95 66.95,17.95 66.75,17.75 66.75,16.55 66.55,16.35 59.6,16.35 56.52,19.42 U1.31
D_PA5
  Top 0.178: U1.30 54.73,19.42 55.55,18.6 56.8,18.6 59.45,15.95 72,15.95 72.25,16.2 IC16.4
D_PA6
  Top 0.178: U1.29 54.15,18.2 56.65,18.2 59.3,15.55 74.4,15.55 75.05,16.2 IC17.4
D_PA7
  Top 0.178: U1.28 52.77,17.8 56.5,17.8 59.15,15.15 76.85,15.15 77.9,16.2 IC18.4
D_PB0  (via drill 0.33)
  Top 0.178: IC2.4 80.4,42.55 80.75,42.9 v81.85,42.9 | v83.25,42.15 84.75,40.65 v84.75,38.45
  Bottom 0.178: v84.75,38.45 83.8,37.5 83.8,28.45 83.4,28.05 83.4,26.55 83.6,26.35 83.6,23.05 82.7,22.15 82.7,19.3 82.05,18.65 81.05,18.65 80.75,18.95 70.3,18.95 70.25,18.9 67.4,18.9 66.15,17.65 51.1,17.65 49.38,19.38 49.38,19.42 U1.27 | v83.25,42.15 82.5,42.9 v81.85,42.9
D_PB1  (via drill 0.33)
  Top 0.178: v84.75,37.5 84.4,37.85 IC6.4
  Bottom 0.178: v84.75,37.5 84.2,36.95 84.2,28.3 83.8,27.9 83.8,26.7 84,26.5 84,22.9 83.1,22 83.1,19.15 82.2,18.25 80.9,18.25 80.6,18.55 70.4,18.55 70.35,18.5 67.55,18.5 66.3,17.25 53,17.25 51.65,15.9 48.3,15.9 47.59,16.61 U1.26
D_PB2  (via drill 0.33)
  Top 0.178: v84.85,34.7 84.5,35.05 IC7.4
  Bottom 0.178: v84.85,34.7 84.6,34.45 84.6,28.15 84.2,27.75 84.2,26.85 84.4,26.65 84.4,22.75 83.5,21.85 83.5,19 82.35,17.85 80.75,17.85 80.45,18.15 70.5,18.15 70.45,18.1 67.7,18.1 66.5,16.9 53.15,16.9 51.8,15.55 48.1,15.55 47.2,16.45 47.2,17.13 45.81,18.51 U1.25
D_PB3  (via drill 0.33)
  Top 0.178: v85.25,31.9 84.9,32.25 IC8.4
  Bottom 0.178: v85.25,31.9 85,31.65 85,28 84.6,27.6 84.6,27 84.8,26.8 84.8,22.6 83.9,21.7 83.9,18.85 82.5,17.45 80.6,17.45 80.3,17.75 70.6,17.75 70.55,17.7 67.85,17.7 66.7,16.55 53.3,16.55 51.95,15.2 46.25,15.2 44.9,16.55 44.9,17.65 44.03,18.52 U1.24
D_PB4  (via drill 0.33)
  Top 0.178: v85.65,29 85.2,29.45 IC10.4
  Bottom 0.178: v85.65,29 85.65,28.1 85,27.45 85,27.15 85.2,26.95 85.2,22.45 84.3,21.55 84.3,18.7 82.65,17.05 80.45,17.05 80.15,17.35 70.7,17.35 70.65,17.3 68,17.3 66.9,16.2 53.45,16.2 52.1,14.85 44.1,14.85 42.55,16.4 42.55,17.65 42.26,17.94 U1.23
D_PB5  (via drill 0.33)
  Top 0.178: v85.75,27.3 85.1,26.65 IC12.4
  Bottom 0.178: v85.75,27.3 85.6,27.15 85.6,22.3 84.7,21.4 84.7,18.55 82,15.85 53.6,15.85 52.25,14.5 43.95,14.5 42.2,16.25 42.2,17.45 40.48,19.17 U1.22
D_PB6  (via drill 0.33)
  Top 0.178: IC13.4 84.3,23.85 85.75,22.4 v85.75,21.5
  Bottom 0.178: v85.75,21.5 85.1,20.85 85.1,18.4 82.2,15.5 53.75,15.5 52.4,14.15 42.3,14.15 40.05,16.4 40.05,17.15 38.7,18.5 U1.21
D_PB7  (via drill 0.33)
  Top 0.178: v85.75,20.15 85.15,20.15 84.25,21.05 IC14.4
  Bottom 0.178: v85.75,20.15 85.75,18.5 82.4,15.15 53.9,15.15 52.55,13.8 42.15,13.8 39.65,16.3 39.65,17 38.3,18.35 37.5,18.35 36.92,18.93 U1.20
D_PC0
  Bottom 0.178: U1.48 IC9.48
D_PC1
  Bottom 0.178: U1.47 IC9.47
D_PC2
  Bottom 0.178: U1.46 IC9.46
D_PC3
  Bottom 0.178: U1.45 IC9.45
D_PC4
  Bottom 0.178: U1.44 IC9.44
D_PC5
  Bottom 0.178: U1.43 IC9.43
D_PC6
  Bottom 0.178: U1.42 IC9.42
D_PC7
  Bottom 0.178: U1.41 IC9.41
D_PD0
  Bottom 0.178: U1.40 IC9.40
D_PD1
  Bottom 0.178: U1.39 IC9.39
D_PD2
  Bottom 0.178: U1.38 IC9.38
D_PD3
  Bottom 0.178: U1.37 IC9.37
D_SCLK
  Top 0.178: IC9.13 U1.13
  Bottom 0.178: U1.13
D_SIN0
  Top 0.178: IC9.17 U1.17
D_SIN1
  Top 0.178: IC9.16 U1.16
D_SIN2
  Top 0.178: IC9.15 U1.15
D_SIN3
  Top 0.178: IC9.14 U1.14
D_SOUT0
  Bottom 0.178: IC9.19 U1.19
D_SOUT1
  Top 0.178: IC9.18 U1.18
GND  (via drill 0.33)
  Top 0.178: v73,19.6 73,19 72.9,18.9 IC16.2 | 75.5,19.55 75.5,19.1 75.7,18.9 IC17.2 | v78.35,19.6 78.35,19.1 78.55,18.9 IC18.2 | v81.05,24.4 81.15,24.5 IC13.2 | v81.05,27.05 81.3,27.3 IC12.2 | v81.05,32.9 IC8.2 | v81.05,35.7 IC7.2 | v81.05,30.1 IC10.2 | v81.05,38.5 IC6.2 | IC11.11 78.05,28.65 77.8,28.4 77.8,28 77.25,27.45 v75.75,27.45 | IC15.2 70.1,17.95 69.9,17.75 69.15,17.75 68.55,18.35 66.5,18.35 65.9,17.75 C2.1
  Top 0.305: v81.05,21.7 IC14.2 | 75.5,19.55 v75.5,19.6 75.5,20.5 74.85,21.15 IC11.95 74.85,23.15 v74.55,23.45 | IC3.2 71.35,38.9 v71.6,38.65 71.35,38.4 IC11.38 | v74.25,39 74.25,39.4 74.15,39.5 IC4.2 | v77.3,39.3 76.95,39.65 IC1.2 | v79.75,39.3 IC2.2 79.75,40.85 80,41.1 81,41.1 83,43.1 85.5,43.1 v85.95,42.65 86.45,42.15 86.45,16.65 v86.1,16.3 83.7,16.3 | IC11.59 64.8,31.65 v65.15,32 | v66.9,27.35 66,26.45 66,25.4 64.75,24.15 IC11.74 62.75,24.15 v62.4,24.5 | 83.7,16.3 83.7,18.3 83.45,18.3 C1.2 | C3.2 IC19.2 83.7,16.3 | v77.3,39.3 | v77.3,39.3 | IC11.26 77.75,37.15 v78.3,37.7 | v79.2,36.8 79.2,36.95 80.75,38.5 v81.05,38.5 | v81.05,38.5 | IC9.32 U1.32 58.93,20.1 60.1,20.1 v61.55,18.65 63.05,17.15 C2.1 | IC9.32 58.25,22.1 | v67.05,40.85 67.8,40.85 68.3,40.35 IC5.2 68.3,39.3 v68.7,38.9 68.85,38.75 IC11.43 68.85,36.2 69.05,36 69.05,34.75 v71.95,31.85 v71.95,28.8 v71.95,27.35 | v62.8,36.3 62.8,38.25 | 62.8,38.25 62.8,39.85 v61.7,40.95 | v26,36.75 25.65,36.4 v24.3,36.4 | v54.85,25.5 55.5,25.5 58.26,22.74 IC9.32 | 62.8,38.25 v60.6,38.25 60.05,37.7 43.3,37.7 43.2,37.8 v43.15,37.8 | IC9.12 22.7,20.65 21.8,19.75 v21.8,18.85 | TP_GND.TP 1,39.45 0.55,39 0.55,28.55 | v73.25,27.3 v73.25,28.8 v73.25,31.85 76.6,35.2 v77.55,35.2 | v70.5,31.85 v70.5,28.8 | 0.55,28.55 v2.4,28.55 | IC11.86 70.35,23.35 v70.4,23.4 | v48.7,22.95 49.7,22.95 50.25,22.4 50.25,18.95 v49.55,18.25 51.45,18.25 52.4,17.3 52.4,2.67 IC100.14 | v29.9,35.5 v31.4,35.5 | 0.55,28.55 0.55,20.4 3.8,17.15 16.25,17.15 17.9,15.5 17.9,12.35 v18.2,12.05 v21.8,15.65
  Bottom 0.178: v78.35,19.6 78.5,19.6 | v81.05,24.4 81.7,25.05 81.7,25.65 81.05,26.3 v81.05,27.05 81.7,27.7 81.7,28.3 81.05,28.95 v81.05,30.1 v81.05,32.9 81.7,33.55 81.7,34.15 81.05,34.8 v81.05,35.7 81.7,36.35 81.7,36.9 81.05,37.55 v81.05,38.5 | 75.45,19.6 v75.5,19.6 | v75.75,27.45 75.4,27.45 74.85,26.9 C106.1
  Bottom 0.279: 5.8,18.05 5.8,19.85 7.6,21.65
  Bottom 0.305: v75.5,19.6 75.7,19.4 78.15,19.4 v78.35,19.6 78.55,19.4 79.6,19.4 79.9,19.7 79.9,20.15 81.05,21.3 v81.05,21.7 81.25,21.9 81.25,24.2 v81.05,24.4 | C107.1 C108.1 71.95,26.5 | C117.1 C118.1 C119.1 C120.1 C121.1 66.15,32.3 65.85,32 v65.15,32 | v71.95,31.85 C117.1 | 70,19.4 69.95,19.35 70,19.4 | 70,19.4 72.8,19.4 v73,19.6 73.2,19.4 75.25,19.4 75.45,19.6 | 70,19.4 | 73.65,39.7 74.25,39.1 | 73.65,39.7 | 73.65,39.7 72.65,39.7 v71.6,38.65 71.6,38.7 70.95,39.35 70.35,39.35 69.9,38.9 v68.7,38.9 | C117.1 C116.1 | C109.1 67.45,26.25 | C109.1 C110.1 66.15,26.95 66.55,27.35 v66.9,27.35 68.05,27.35 68.35,27.65 69.1,27.65 | 71.08,22.73 71.6,22.2 73.3,22.2 v74.55,23.45 75.6,22.4 | 71.08,22.73 v70.4,23.4 | C107.1 C106.1 C105.1 | 70,19.4 70,19.35 67.5,19.35 | v81.05,38.5 81.25,38.5 81.85,39.1 81.85,39.75 81.3,40.3 80.75,40.3 v79.75,39.3 v77.3,39.3 77.3,39.45 76.75,40 76,40 | 76,40 | 74.25,39.1 75.1,39.1 76,40 | 76,40 | 74.25,39.1 v74.25,39 | v74.25,39 | v79.2,36.8 v78.3,37.7 | v62.4,24.5 61.4,25.5 v54.85,25.5 60.5,31.15 60.5,33.75 62.8,36.05 v62.8,36.3 | JP100.GND 79.85,24.29 79.85,22.2 79.4,21.75 76.25,21.75 75.6,22.4 | v85.95,42.65 C125.1 C124.1 | 67.5,19.35 67.2,19.35 66.3,18.45 61.73,18.45 61.73,18.47 v61.55,18.65 | v67.05,40.85 66.05,41.85 v64.6,41.85 59,41.85 58.85,42 36.05,42 | v61.7,40.95 61.7,41.8 | 36.05,42 31.1,42 30.7,41.6 30.7,37.95 30.65,37.9 | 30.05,37.3 29.35,36.6 | 29.35,36.6 26.15,36.6 v26,36.75 | v24.3,36.4 13.5,36.4 10.65,33.55 | 10.65,33.55 10.6,33.5 10.6,27.85 | 10.6,27.85 8.3,27.85 7.6,27.15 7.6,25.4 8.13,24.87 | C111.2 16.75,27.25 16.15,27.85 10.6,27.85 | 8.13,24.87 8.97,24.87 C112.1
  Bottom 0.305: v2.4,28.55 C115.1 | v71.95,27.35 71.95,26.5 | v73.25,27.3 73.4,27.15 C107.1 | v73.25,28.8 v71.95,28.8 v70.5,28.8 v69.25,28.8 | v71.95,31.85 v70.5,31.85 | C122.1 C123.1 74.3,33.15 74.1,32.95 C116.1 | C116.1 73.4,32 v73.25,31.85 v71.95,31.85 | 8.13,24.87 7.6,24.34 7.6,21.65 | 36.05,42 v36.05,39.15 | C109.1 67.6,26.4 69.05,26.4 C114.1 69.1,26.8 69.1,27.65 | 71.95,26.5 70.5,26.5 C113.1 70.5,27.65 69.1,27.65 | 67.5,19.35 C104.1 | v36.9,20.7 38.75,20.7 v38.85,20.6 40.6,20.6 v40.65,20.55 42.35,20.55 v42.4,20.6 44.2,20.6 v44.25,20.55 45.9,20.55 v45.95,20.5 47.8,20.5 48.5,19.8 48.5,19 49.25,18.25 v49.55,18.25 | v32.1,37.15 31.4,37.15 30.65,37.9 | v29.9,35.5 29.9,36.05 29.35,36.6 | v29.95,37.3 30.05,37.3 | 30.05,37.3 30.65,37.9 | v76.75,23.5 76.7,23.5 75.6,22.4 | 71.08,22.73 v71.8,23.45 | 10.65,33.55 10.65,33.9 | C103.1 18.35,13.45 18.2,13.3 v18.2,12.05 | v21.8,18.85 v21.8,15.65
  other vias: 81.1,40.45 80.4,41.15 21.35,36.35 18.35,34.35 17.35,32.35 15.35,32.35 16.35,34.35 19.35,36.35 17.35,36.35 14.35,34.35 13.35,32.35 11.35,32.35 9.35,32.65 7.35,32.65 12.35,34.35 15.35,36.35 13.35,36.35 11.35,36.35 9.35,36.35 7.35,36.35 3.35,36.35 8.35,35.05 10.35,35.05 2.35,34.35 1.35,36.35 1.35,41.45 6.35,42.35 8.35,42.35 10.35,42.35 12.35,42.35 14.35,42.35 16.35,42.35 18.35,42.35 20.35,42.35 22.35,42.35 24.35,42.35 26.35,42.35 1.35,38.35 1.35,31.35 85.35,36.35 85.35,33.35 84.35,42.35 59.35,38.35 50,21.2 1.35,27.35 1.35,29.35 1.35,23.35 1.35,25.35 1.35,19.35 1.35,21.35 1.35,17.3 23.35,36.35 22.35,34.35 20.35,34.35 19.35,32.35 4.35,27.35 3.35,25.35 6.35,27.35 6.4,18.3 4.4,18.3 5.35,25.35 4.35,23.35 2.35,23.35 25.45,8 22.45,6 23.45,8 21.45,8 31.45,8 30.5,6 28.5,6 27.5,8 26.5,6 33.5,8 38.5,6 35.5,4 36.5,6 39.5,8 33.5,4 35.5,8 40.5,6 44.5,6 43.5,4 41.5,4 42.5,6 45.5,8 43.5,8 41.5,8 46.5,6 50.5,6 49.5,4 51.5,8 49.5,8 52.5,6 51.5,4 31.45,4 27.5,4 23.45,4 21.45,4 18.45,6 25.45,4 25.45,12 23.45,12 26.45,14 21.45,12 22.45,14 27.45,12 31.45,12 30.5,14 28.45,14 33.45,12 35.45,12 38.45,14 36.45,14 39.45,12 43.45,12 41.45,12 40.45,14 45.45,12 49.45,12 51.45,12
  pour Top (isolate 0.152, rank 2): -1.45,44.7 87.8,44.7 87.85,-2.6 -1.45,-2.6
  pour Bottom (isolate 0.152, rank 2): -1.45,44.7 87.8,44.7 87.8,-2.6 -1.45,-2.6
GND6  (via drill 0.33)
  other vias: 6.35,23.35
TCK  (via drill 0.33)
  Top 0.178: IC11.62 64.95,30.15 65.05,30.25 65.75,30.25 v66,30.5 | v75.25,28.7 76.5,28.7 v77.05,28.15
  Bottom 0.178: v66,30.5 67,29.5 74.4,29.5 75.2,28.7 v75.25,28.7 | v77.05,28.15 77.37,27.83 JP100.TCK
TDI  (via drill 0.33)
  Top 0.178: IC11.4 77.95,25.15 76.7,26.4 75.35,26.4 74.25,27.5 74.25,29.65 75.05,30.45 75.05,31.5 75.4,31.85 76,31.85 76.35,31.5 v77.1,31.5
  Bottom 0.178: v77.1,31.5 77.5,31.5 78.85,32.85 JP100.TDI
TDO  (via drill 0.33)
  Top 0.178: IC11.73 64.65,24.65 65.5,25.5 65.5,27.3 v66.1,27.9 | v76.05,29.35 76.4,29.35 76.75,29 v77.45,29
  Bottom 0.178: v66.1,27.9 66.3,28.1 74.95,28.1 75,28.05 75.5,28.05 75.9,28.45 75.9,29.2 v76.05,29.35 | v77.45,29 78.82,30.37 JP100.TDO
TMS  (via drill 0.33)
  Top 0.178: IC11.15 78.05,30.65 78,30.7 v77.55,30.7
  Bottom 0.178: v77.55,30.7 78.1,31.25 78.55,31.25 79.8,32.5 79.8,33.3 78.85,34.25 JP100.TMS 78,36.3 R107.1
VCC  (via drill 0.33)
  Top 0.178: IC19.3 80.8,15.35 80.6,15.55 80.6,17.8 80.8,18 C3.1
  Top 0.305: TP_VCC.TP 2.15,41.9 2.9,41.15 3.17,41.15 IC9.64 | IC19.1 82.65,17.6 82.25,18 C3.1 81.4,19.65 | 81.4,19.65 v81.55,19.8 | v71.5,16.65 IC15.6 | v74.3,16.65 IC16.6 | IC18.6 v79.95,16.65 80.15,16.85 80.15,19.35 v80.6,19.8 80.65,19.75 80.65,19.7 80.7,19.65 81.4,19.65 | v77.1,16.65 IC17.6 | IC14.6 83.8,22.65 83.15,23.3 v82.95,23.3 | v82.95,26.1 83.15,26.1 83.8,25.45 IC13.6 | v83.15,28.7 83.35,28.7 83.8,28.25 IC12.6 | v82.95,31.3 83.55,31.3 83.8,31.05 IC10.6 | v83.15,34.3 83.35,34.3 83.8,33.85 IC8.6 | v83.15,37.1 83.35,37.1 83.8,36.65 IC7.6 | v83.15,39.9 83.35,39.9 83.8,39.45 IC6.6 | v78.35,41.95 79.1,41.95 IC2.6 | v75.55,41.95 76.3,41.95 IC1.6 | IC4.6 72.85,41.95 v72.75,42.05 | v69.95,42.05 | v69.95,42.05 70.05,41.95 IC3.6 | v66.9,42.05 67.3,41.65 IC5.6 | v72.75,42.05 | v68.7,16.65 68.2,17.15 C2.2
  Bottom 0.305: U1.64 IC9.64 3.15,41.13 3.15,42.75 | v81.55,19.8 81.75,20 81.75,23.55 82.15,23.95 82.15,31.6 82.45,31.9 82.45,37.9 82.35,38 82.35,40.15 80.55,41.95 v78.35,41.95 v75.55,41.95 72.85,41.95 v72.75,42.05 | 3.5,43.1 3.15,43.1 | 65.85,43.1 3.5,43.1 | 65.85,43.1 80.7,43.1 81.55,42.25 82.15,42.25 82.35,42.45 82.6,42.2 82.6,41.85 82.85,41.6 82.5,41.25 82.5,40.45 83.05,39.9 v83.15,39.9 | 0.55,32.4 0.55,32.05 | 0.55,32.75 0.55,32.4 | 0.55,42.4 0.55,32.75 | 1.25,43.1 0.55,42.4 | 2.8,43.1 1.25,43.1 | 3.15,43.1 2.8,43.1 | 0.55,32.4 0.9,32.4 | 0.9,32.4 C115.2 | 0.9,32.4 0.55,32.05 | 0.55,32.75 0.9,32.4 | 0.55,42.4 0.55,42.7 0.95,43.1 1.25,43.1 | 3.15,43.1 3.15,42.75 | 3.5,43.1 3.15,42.75 | 3.15,42.75 2.8,43.1 | 0.55,32.05 0.55,23.1 2.15,21.5 2.15,18.8 3.45,17.5 17.51,17.5 IC100.28 18.2,16.73 C103.2 | v79.95,16.65 v77.1,16.65 v74.3,16.65 v71.5,16.65 v68.7,16.65 | v83.15,39.9 v83.15,37.1 v83.15,34.3 83.15,31.5 v82.95,31.3 82.95,28.9 v83.15,28.7 82.95,28.5 v82.95,26.1 v82.95,23.3 82.25,22.6 82.25,19.5 81.85,19.1 81.25,19.1 80.6,19.75 v80.6,19.8 | v72.75,42.05 | v72.75,42.05 v69.95,42.05 v66.9,42.05 65.85,43.1 | v83.15,39.9 C124.2
  pour Top: 80.05,20.05 82.65,20.1 82.65,15 76.75,15 78.45,16.75 80.05,16.75
  pour Bottom: 82.3,20.2 82.3,19.5 81.85,19.05 81.2,19.05 80.45,19.8 80.45,19.95 80.5,20 81.75,20
  pour Bottom: 67.1,16.05 67.1,17.25 70.7,17.25 71.1,17.3 80.1,17.3 80.5,16.9 82.6,16.95 82.6,16.55 82.1,16.05
  pour Bottom: 65.9,43.1 66.95,42.05 72.75,42.05 72.85,41.95 80.5,41.95 82.35,40.1 82.35,38 82.45,37.9 82.45,31.9 82.15,31.6 82.15,23.9 81.75,23.5 81.75,20 81.55,19.8 80.6,19.8 81.3,19.1 81.85,19.1 82.25,19.5 82.25,22.6 82.95,23.3 82.95,31.3 83.15,31.5 83.15,39.85 82.5,40.45 82.5,41.25 82.85,41.6 82.6,41.85 82.6,42.2 82.35,42.45 82.15,42.25 81.55,42.25 80.7,43.1
VCC_CPLD  (via drill 0.33)
  Top 0.305: v65.15,35.45 64.95,35.65 IC11.51 | v70.75,35.85 70.75,36.15 70.85,36.25 IC11.39 70.85,38.45 v70.65,38.65 70.65,39.35 70.7,39.4 | v73.6,35.85 73.35,36.1 IC11.34 | v77.4,32.4 77.65,32.15 IC11.18 | v72.85,23.45 IC11.91 | v68.6,24.05 68.5,23.95 68.5,23.2 68.35,23.05 IC11.82 | v65.15,27.85 64.85,28.15 IC11.66 | IC11.3 v77.55,24.65 77.55,23.45 80.5,20.5 83.95,20.5 85.15,19.3 C1.1 IC19.5 | IC15.1 70.75,19.6 v70.25,20.1 | IC16.1 73.55,18.95 73.7,19.1 73.7,20.2 v73.65,20.25 | v76.35,20.1 IC17.1 | v79.2,20.1 IC18.1 | v80.55,22.5 80.6,22.45 81.4,22.45 81.5,22.35 IC14.1 | v81.05,25.35 81.25,25.15 IC13.1 | v81.05,28 81.1,27.95 IC12.1 | v81.05,33.85 81.25,33.85 81.55,33.55 IC8.1 | v81.05,36.65 81.35,36.35 IC7.1 | v80.35,30.8 81.45,30.8 81.5,30.75 IC10.1 | v73.3,39 73.5,39.2 IC4.1 | v79,38.45 79,39.55 79.1,39.65 IC2.1 | v67.85,38.45 67.85,38.95 67.65,39.15 IC5.1 | IC1.1 76.3,39.3 v76.35,39.25 | IC6.1 81.35,39.15 v81.05,39.45 82.5,40.9 v83.15,40.9 | 70.7,39.4 | 70.7,39.4 IC3.1
  Bottom 0.178: v73.6,35.85 74.05,36.3 R107.2
  Bottom 0.305: C116.2 C117.2 C118.2 | C118.2 C119.2 C120.2 C121.2 66.15,35.4 65.9,35.65 65.35,35.65 v65.15,35.45 | C107.2 C108.2 71.95,24.8 70.5,24.8 C113.2 C114.2 68.97,25.02 | C109.2 C110.2 65.15,24.55 v65.15,27.85 | C107.2 C106.2 C105.2 76.95,24.55 77.05,24.65 v77.55,24.65 | v70.75,35.85 70.5,35.6 C118.2 | v73.6,35.85 73.4,35.65 C116.2 | C107.2 73.4,23.85 73,23.45 v72.85,23.45 | v77.55,24.65 77.55,26.65 76.35,27.85 76.35,28.45 76.75,28.85 76.75,30.85 76.35,31.25 76.35,31.75 76.8,32.2 77.2,32.2 v77.4,32.4 77.4,34.35 76.9,34.85 C122.2 C123.2 74.25,34.85 74.05,34.65 C116.2 | v79.2,20.1 79,20.3 76.55,20.3 v76.35,20.1 76.15,20.3 73.7,20.3 v73.65,20.25 73.6,20.3 72.7,20.3 72.55,20.15 70.25,20.15 v70.25,20.1 70.15,20.2 C104.2 | v79.2,20.1 79.2,20.05 | v67.85,38.45 68.1,38.2 70.2,38.2 v70.65,38.65 70.65,38.6 71.3,37.95 71.9,37.95 72.95,39 v73.3,39 73.3,38.9 73.9,38.3 | v76.35,39.25 75.4,38.3 73.9,38.3 | 73.9,38.3 | 80.1,38.45 80.1,38.6 80.95,39.45 v81.05,39.45 | 80.1,38.45 80.1,37.6 v81.05,36.65 80.85,36.65 80.25,36.05 80.25,34.65 v81.05,33.85 81,33.85 80.35,33.2 v80.35,30.8 80.35,28.7 v81.05,28 81,28 80.35,27.35 80.35,26.05 v81.05,25.35 81,25.35 80.35,24.7 80.35,22.7 v80.55,22.5 80.35,22.3 80.35,21.4 79.2,20.25 v79.2,20.1 | v76.35,39.25 | v76.35,39.25 77.15,38.45 v79,38.45 80.1,38.45 | JP100.VCC 77.55,24.05 v77.55,24.65 | v83.15,40.9 83.6,41.35 C125.2 | 68.97,25.02 68.75,24.8 | C109.2 67.6,24.8 | C109.2 68.1,24.55 v68.6,24.05 68.97,24.42 68.97,25.02
  pour Top (no thermals): 77.5,22.85 78.2,23.55 79.7,23.55 79.9,23.35 79.9,22.95 79.6,22.65 79.6,22.05 80.7,20.95 81.6,20.95 81.6,20.45 79.8,20.45 79.4,20.85 77.95,20.85 77.5,21.3

## Text on the board
tPlace: 12 | 16 | ToyoTune LVC-D28 1.3 | Copyright 2013, Jon Sole, Jon Hacker
bPlace: TMS | TDI | TDO | TCK | GND | VCC